# Altium schematic sheet Sheet_LoraE32_Receive_V1.0.SchDoc
size A4
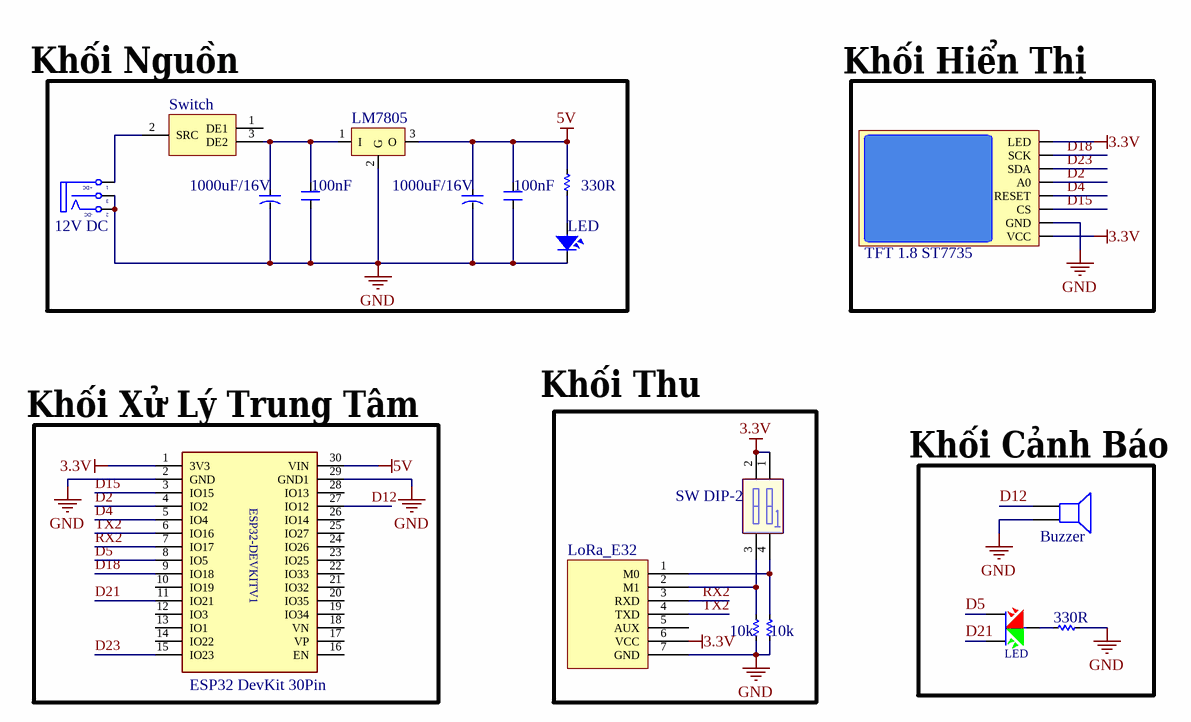
[diagram p0: Sheet_LoraE32_Receive_V1.0.SchDoc]

## Parts
*  LoRa_E32  [LoRa_E32]
C1  1000uF/16V  [CAP-ALU-SMD-G]
C2  1000uF/16V  [CAP-ALU-SMD-G]
C3  100nF  [CN2]
C4  100nF  [CN2]
CN1  12V DC  [DC-IN]
ic1  ESP32 DevKit 30Pin  [ESP32 DevKit V1 30Pin CAo]
IC2  LM7805  [TO220H1]
LED1  LED  [LED-52]
LED2  LED  [LED-0805-Green]
LS1  Buzzer  [SPEAKER]
R1  330R  [RES-SMD-0805]
R2  10k  [RES-SMD-0805]
R3  330R  [RES-SMD-0805]
R4  10k  [RES-SMD-0805]
S2  Switch  [Switch]
SW1  SW DIP-2  [DIPSW2]
TFT1  TFT 1.8 ST7735  [TFT 1.8 ST7735]

## Nets
3.3V: *.6(VCC) ic1.1(3V3) SW1.1(A1) SW1.2(A2) TFT1.1(LED) TFT1.8(VCC)
5V: C2.1 C4.2 ic1.30(VIN) IC2.3(O) R1.1
GND: *.7(GND) C1.2 C2.2 C3.1 C4.1 CN1.2(TN) CN1.3(S) ic1.2(GND) ic1.29(GND1) IC2.2(G) LED2.2 LS1.2 R2.2 R3.2 R4.2 S2.4 S2.5 TFT1.7(GND)
D2: ic1.4(IO2) TFT1.4(A0)
D4: ic1.5(IO4) TFT1.5(RESET)
D5: ic1.8(IO5) LED1.1
D12: ic1.27(IO12) LS1.1
D15: ic1.3(IO15) TFT1.6(CS)
D18: ic1.9(IO18) TFT1.2(SCK)
D21: ic1.11(IO21) LED1.3
D23: ic1.15(IO23) TFT1.3(SDA)
RX2: *.3(RXD) ic1.7(IO17)
TX2: *.4(TXD) ic1.6(IO16)
Net*_1: *.1(M0) R4.1 SW1.4(B1)
Net*_2: *.2(M1) R2.1 SW1.3(B2)
NetC1_1: C1.1 C3.2 IC2.1(I) S2.3(DE2)
NetCN1_1: CN1.1(T) S2.2(SRC)
NetLED1_2: LED1.2 R3.1
NetLED2_1: LED2.1 R1.2

Not connected (* = marked no-connect by the designer): * 5(AUX); ic1 10(IO19) 12(IO3) 13(IO1) 14(IO22) 16(EN) 17(VP) 18(VN) 19(IO34) 20(IO35) 21(IO32) 22(IO33) 23(IO25) 24(IO26) 25(IO27) 26(IO14) 28(IO13); S2 1(DE1)

## Notes on the sheet
- (near S2) Khối Nguồn
- Khối Hiển Thị
- Khối Thu
- (near ic1) Khối Xử Lý Trung Tâm
- (near LS1) Khối Cảnh Báo
- ĐỀ TÀI:
- ỨNG DỤNG MẠNG KHÔNG DÂY LORA TRONG HỆ THỐNG GIÁM SÁT CHẤT LƯỢNG MÔI TRƯỜNG
- SVTH:
- GVHD:
- MSSV:
- (in symbol DCIN) +DC; -DC
- (in symbol ESP32 DevKit 30Pin) ESP32-DEVKITV1

## Library data of the parts
C1 C2 = CN-ALU-SMD: Polarized Capacitor (Axial); Published: 8-Jun-2000; LatestRevisionDate: 17-Jul-2002; LatestRevisionNote: Re-released for DXP Platform.; PackageReference: POLAR0.8; Publisher: Altium Limited
C3 C4 = CN2: Cap np 104 => 105pF; Value: 0.1uF
CN1 = DCIN: Jac DC input; Value: Jac DC
IC2 = LM78xx: Positive Voltage Regulator; Note: Tab is connected to pin 3 (GND).; Published: 24-Aug-2001; LatestRevisionDate: 17-Jul-2002; LatestRevisionNote: Re-released for DXP Platform.; DatasheetVersion: Apr-1994; PackageVersion: Jul-1998; PackageReference: ISOWATT220AB; Publisher: Altium Limited; PackageDescription: TO, Thru-Hole, Vertical, Heatsink Mounted; 3 In-Line Leads; Pitch 2.54 mm; Pin sequence 1, 3, 2; ComponentLink1Description: Manufacturer Link; ComponentLink1URL: http://www.st.com/; ComponentLink2Description: Datasheet; ComponentLink2URL: http://www.st.com/stonline/products/literature/ds/2146/l78m05c.pdf
LED1 = LED 2A: Anot Comment Green and Red; Value: LED 3 - 5 ly 2 Colour
LED2 = LED SMD: Value: LED 3 - 5 ly 2 Colour
LS1 = Speaker: Loudspeaker; Published: 24-Mar-1999; LatestRevisionDate: 17-Jul-2002; LatestRevisionNote: Re-released for DXP Platform.; PackageReference: PIN2; Publisher: Altium Limited
R1-R4 = Res-SMD: Resistor; Manufacturer: Generic Components; Class: Passive; Published: 08/06/2000; Publisher: Altium Hobart Technology Centre
SW1 = SW DIP-2: DIP Switch, 2 Position, SPST; Vendor: Digikey; Published: 24-Mar-1999; LatestRevisionDate: 17-Jul-2002; LatestRevisionNote: Re-released for DXP Platform.; PackageReference: DIP-4; Publisher: Altium Limited; ComponentLink1Description: Digikey Part Link; ComponentLink2Description: Open Datasheet; ComponentLink2URL: H:\LIBRARY\LIBRARY.Datasheet\
TFT1 = TFT 1.8 ST7735: TFT LCD 1.8 inch RED BLUE 8pin; ComponentLink1Description: New link; ComponentLink1URL: https://grabcad.com/library/1-8-tft-128x160-spi-step-1